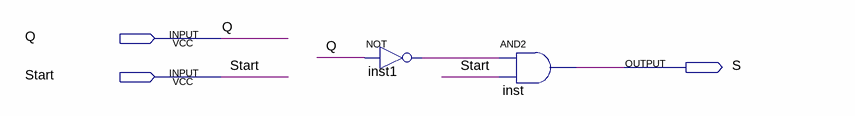
[diagram p0: schematic sheet]
// Quartus schematic OutputBlock2.bdf as structural Verilog: 2 symbols, 3 pins
module OutputBlock2 (
  input  Q,
  input  Start,
  output S
);

  wire inst1_out;

  not inst1 (inst1_out, Q);
  and inst (S, inst1_out, Start);
endmodule
